# Altium project PDM-C.PrjPcb
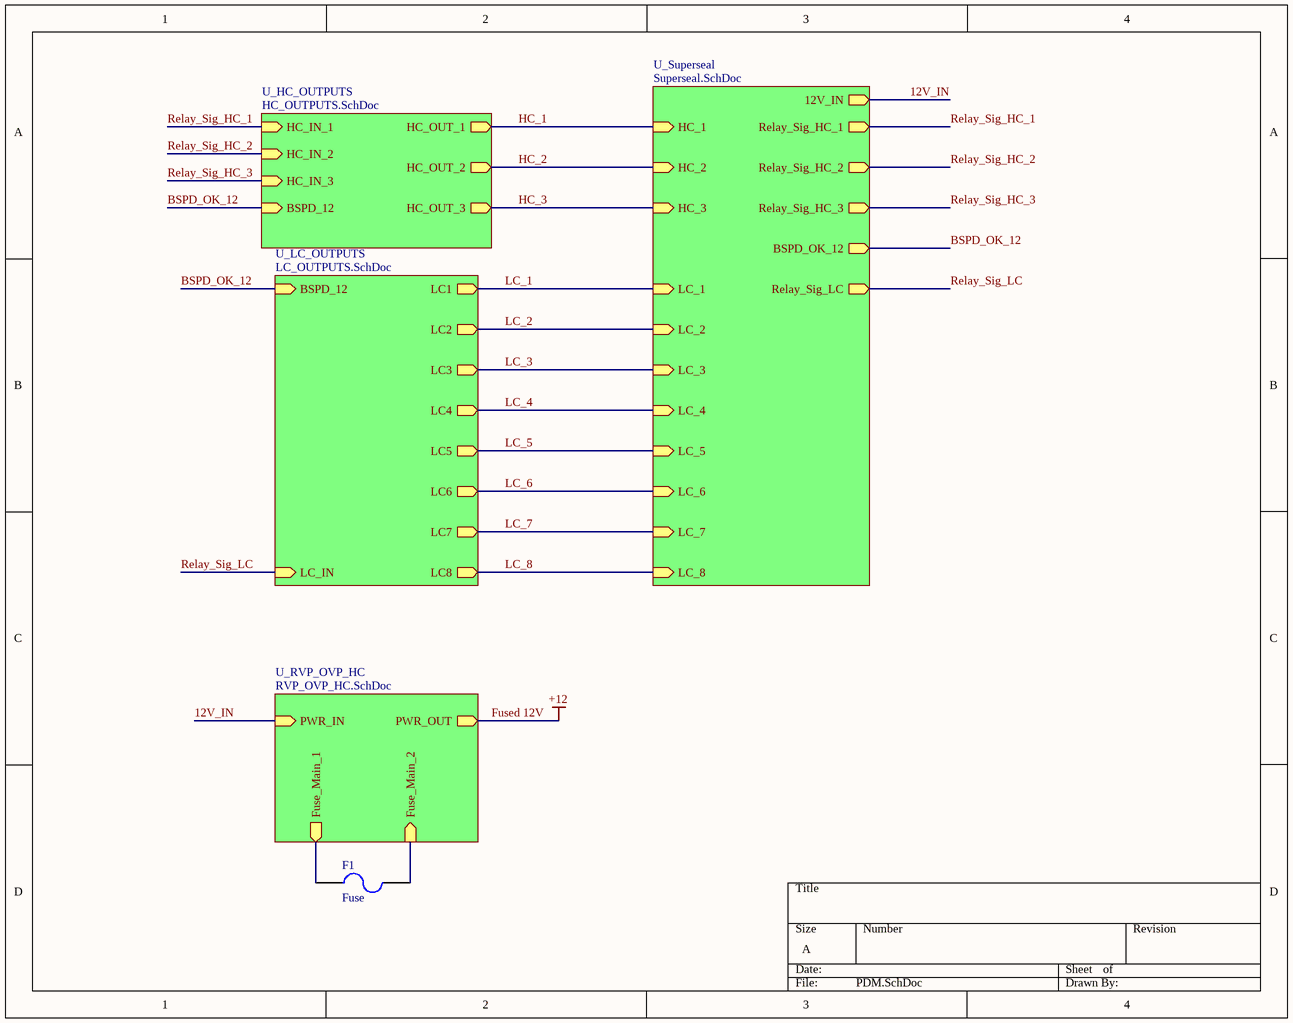
[diagram p0: PDM.SchDoc]
7 sheets, 85 parts. Net scope: hierarchical (ports join the sheet entries above them; power ports are global).
Board files: PDM-C_Rev2.PcbDoc, PDM-C_Rev3.PcbDoc
Sheets:
  PDM.SchDoc
    U_LC_OUTPUTS = LC_OUTPUTS.SchDoc
      U_Blown_Fuse_LED = Blown_Fuse_LED.SchDoc
      U_Relay = Relay.SchDoc
      U_Blown_Fuse_LED = Blown_Fuse_LED.SchDoc
      U_Blown_Fuse_LED = Blown_Fuse_LED.SchDoc
      U_Blown_Fuse_LED = Blown_Fuse_LED.SchDoc
      U_Blown_Fuse_LED = Blown_Fuse_LED.SchDoc
      U_Blown_Fuse_LED = Blown_Fuse_LED.SchDoc
      U_Blown_Fuse_LED = Blown_Fuse_LED.SchDoc
      U_Blown_Fuse_LED = Blown_Fuse_LED.SchDoc
    U_HC_OUTPUTS = HC_OUTPUTS.SchDoc
      U_Blown_Fuse_LED = Blown_Fuse_LED.SchDoc
      U_Relay = Relay.SchDoc
      U_Blown_Fuse_LED = Blown_Fuse_LED.SchDoc
      U_Relay = Relay.SchDoc
      U_Blown_Fuse_LED = Blown_Fuse_LED.SchDoc
      U_Relay = Relay.SchDoc
    U_RVP_OVP_HC = RVP_OVP_HC.SchDoc
    U_Superseal = Superseal.SchDoc

## Sheet PDM.SchDoc
size A

### Parts
(Parts that share a designator on the sheet are numbered #1, #2 ... from top to bottom, then left to right.)
F1#1  Fuse  [3568-MiniFuseHolder]

### Sub-sheets
U_HC_OUTPUTS = HC_OUTPUTS.SchDoc: HC_IN_1 (in), HC_OUT_1 (out), HC_IN_2 (in), HC_OUT_2 (out), HC_IN_3 (in), HC_OUT_3 (out), BSPD_12 (in)
U_LC_OUTPUTS = LC_OUTPUTS.SchDoc: LC8 (out), LC1 (out), LC2 (out), LC3 (out), LC4 (out), LC5 (out), LC6 (out), LC7 (out), LC_IN (in), BSPD_12 (in)
U_RVP_OVP_HC = RVP_OVP_HC.SchDoc: PWR_IN (in), PWR_OUT (out), Fuse_Main_1 (out), Fuse_Main_2 (in)
U_Superseal = Superseal.SchDoc: 12V_IN (out), Relay_Sig_LC (out), Relay_Sig_HC_1 (out), Relay_Sig_HC_2 (out), HC_1 (in), HC_2 (in), LC_1 (in), LC_2 (in), LC_3 (in), LC_4 (in), LC_5 (in), LC_6 (in), LC_7 (in), LC_8 (in), Relay_Sig_HC_3 (out), HC_3 (in), BSPD_OK_12 (out)

### Nets
Fused 12V: F1#1.2 ; sheet U_RVP_OVP_HC/PWR_OUT, sheet U_RVP_OVP_HC/Fuse_Main_2  [also labelled +12]
12V_IN: F1#1.1 ; sheet U_RVP_OVP_HC/PWR_IN, sheet U_RVP_OVP_HC/Fuse_Main_1, sheet U_Superseal/12V_IN
BSPD_OK_12: sheet U_LC_OUTPUTS/BSPD_12, sheet U_HC_OUTPUTS/BSPD_12, sheet U_Superseal/BSPD_OK_12  [project net BSPD_12]
HC_1: sheet U_HC_OUTPUTS/HC_OUT_1, sheet U_Superseal/HC_1
HC_2: sheet U_HC_OUTPUTS/HC_OUT_2, sheet U_Superseal/HC_2
HC_3: sheet U_HC_OUTPUTS/HC_OUT_3, sheet U_Superseal/HC_3
LC_1: sheet U_LC_OUTPUTS/LC1, sheet U_Superseal/LC_1
LC_2: sheet U_LC_OUTPUTS/LC2, sheet U_Superseal/LC_2
LC_3: sheet U_LC_OUTPUTS/LC3, sheet U_Superseal/LC_3
LC_4: sheet U_LC_OUTPUTS/LC4, sheet U_Superseal/LC_4
LC_5: sheet U_LC_OUTPUTS/LC5, sheet U_Superseal/LC_5
LC_6: sheet U_LC_OUTPUTS/LC6, sheet U_Superseal/LC_6
LC_7: sheet U_LC_OUTPUTS/LC7, sheet U_Superseal/LC_7
LC_8: sheet U_LC_OUTPUTS/LC8, sheet U_Superseal/LC_8
Relay_Sig_HC_1: sheet U_HC_OUTPUTS/HC_IN_1, sheet U_Superseal/Relay_Sig_HC_1
Relay_Sig_HC_2: sheet U_HC_OUTPUTS/HC_IN_2, sheet U_Superseal/Relay_Sig_HC_2
Relay_Sig_HC_3: sheet U_HC_OUTPUTS/HC_IN_3, sheet U_Superseal/Relay_Sig_HC_3
Relay_Sig_LC: sheet U_LC_OUTPUTS/LC_IN, sheet U_Superseal/Relay_Sig_LC

### Library data of the parts
F1#1 = 3: Manufacturer_id: 1; idFuse: 3; Name: 3568 Mini Fuse Holder; Drawer_id: 1

## Sheet LC_OUTPUTS.SchDoc
size A
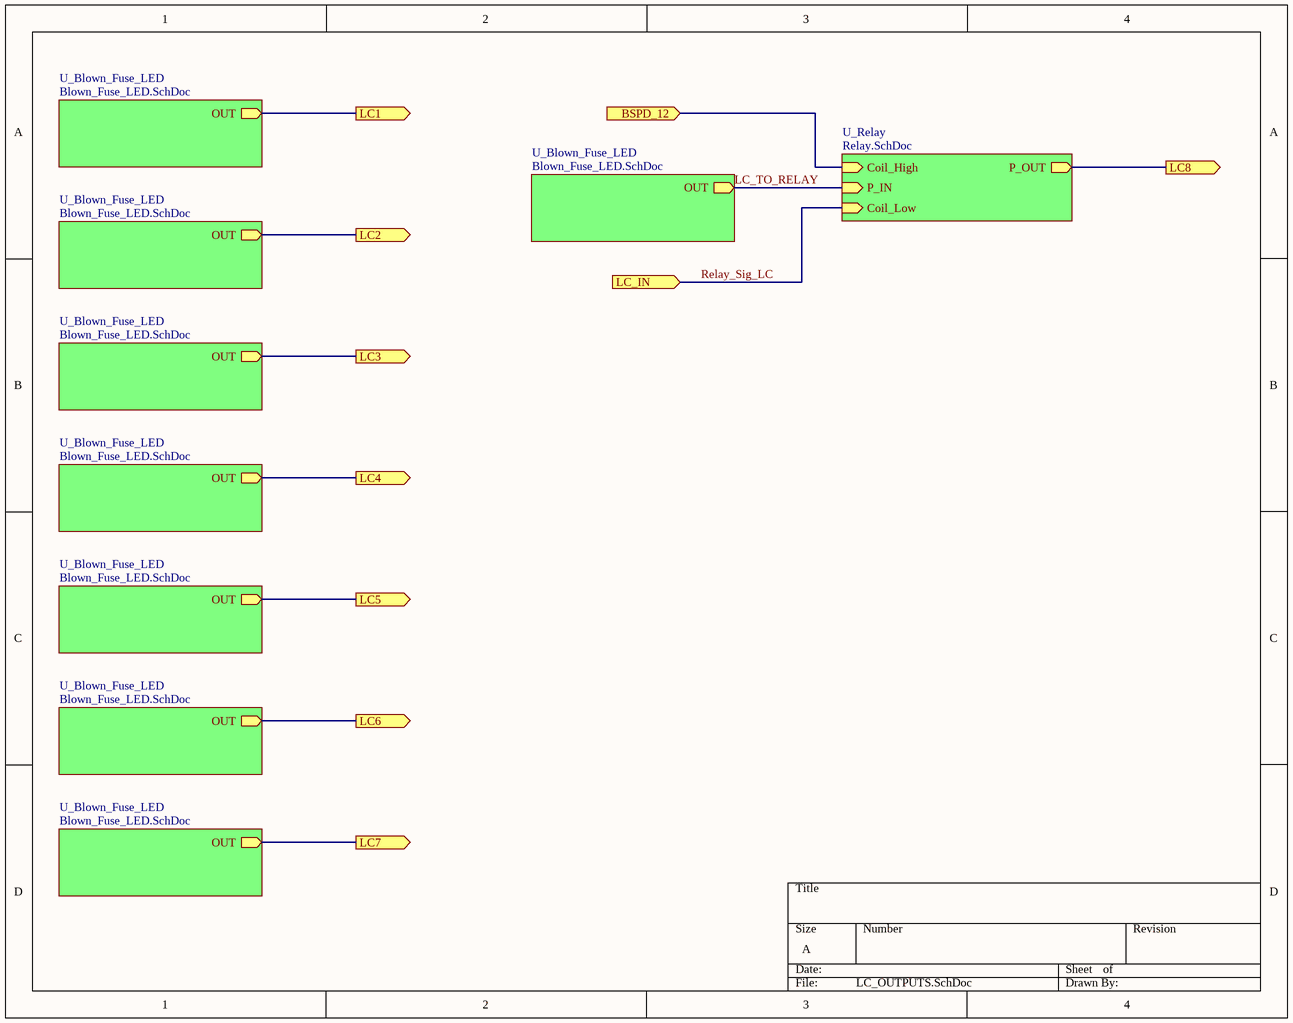
[diagram p1: LC_OUTPUTS.SchDoc]

### Sub-sheets
U_Blown_Fuse_LED = Blown_Fuse_LED.SchDoc: OUT (out)
U_Blown_Fuse_LED = Blown_Fuse_LED.SchDoc: OUT (out)
U_Blown_Fuse_LED = Blown_Fuse_LED.SchDoc: OUT (out)
U_Blown_Fuse_LED = Blown_Fuse_LED.SchDoc: OUT (out)
U_Blown_Fuse_LED = Blown_Fuse_LED.SchDoc: OUT (out)
U_Blown_Fuse_LED = Blown_Fuse_LED.SchDoc: OUT (out)
U_Blown_Fuse_LED = Blown_Fuse_LED.SchDoc: OUT (out)
U_Blown_Fuse_LED = Blown_Fuse_LED.SchDoc: OUT (out)
U_Relay = Relay.SchDoc: P_OUT (out), P_IN (in), Coil_High (in), Coil_Low (in)

### Ports
BSPD_12 (in), LC1 (out), LC2 (out), LC3 (out), LC4 (out), LC5 (out), LC6 (out), LC7 (out), LC8 (out), LC_IN (in)

### Nets
BSPD_12: port BSPD_12, sheet U_Relay/Coil_High
LC_1: port LC1, sheet U_Blown_Fuse_LED/OUT
LC_2: port LC2, sheet U_Blown_Fuse_LED/OUT
LC_3: port LC3, sheet U_Blown_Fuse_LED/OUT
LC_4: port LC4, sheet U_Blown_Fuse_LED/OUT
LC_5: port LC5, sheet U_Blown_Fuse_LED/OUT
LC_6: port LC6, sheet U_Blown_Fuse_LED/OUT
LC_7: port LC7, sheet U_Blown_Fuse_LED/OUT
LC_8: port LC8, sheet U_Relay/P_OUT
LC_TO_RELAY: sheet U_Blown_Fuse_LED/OUT, sheet U_Relay/P_IN
Relay_Sig_LC: port LC_IN, sheet U_Relay/Coil_Low

## Sheet Blown_Fuse_LED.SchDoc
size A
Used 11 times, as channels U_LC_OUTPUTS/U_Blown_Fuse_LED, U_LC_OUTPUTS/U_Blown_Fuse_LED, U_LC_OUTPUTS/U_Blown_Fuse_LED, U_LC_OUTPUTS/U_Blown_Fuse_LED, U_LC_OUTPUTS/U_Blown_Fuse_LED, U_LC_OUTPUTS/U_Blown_Fuse_LED, U_LC_OUTPUTS/U_Blown_Fuse_LED, U_LC_OUTPUTS/U_Blown_Fuse_LED, U_HC_OUTPUTS/U_Blown_Fuse_LED, U_HC_OUTPUTS/U_Blown_Fuse_LED, U_HC_OUTPUTS/U_Blown_Fuse_LED. Parts and nets are listed once, with the designators drawn on the sheet.
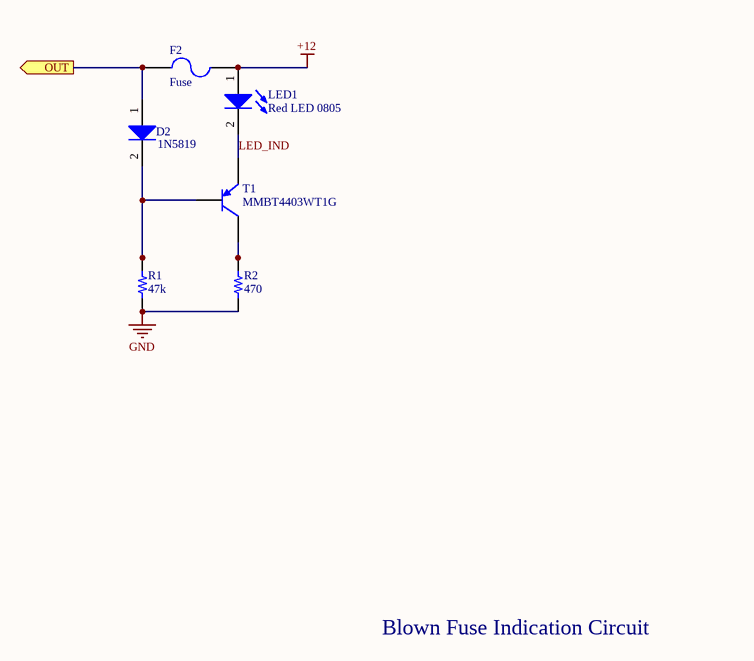
[diagram p2: Blown_Fuse_LED.SchDoc]

### Parts
D2  1N5819  [SOD123F]
F2  Fuse  [3568-MiniFuseHolder]
LED1  Red LED 0805  [0805_LED]
R1  value 47k  [RES 0805/2012]  (hidden comment: Resistor 47k 0805 1/10W 1%)
R2  value 470  [RES 0805/2012]  (hidden comment: Resistor 470 0805 1/10W 1%)
T1  MMBT4403WT1G  [SOT23-3]

### Ports
OUT (out)

### Nets
+12: F2.2 LED1.1(A)
GND: R1.2 R2.2
LED_IND: LED1.2(K) T1.2(E)
OUT: D2.1(A) F2.1 ; port OUT
NetD2_2: D2.2(K) R1.1 T1.1(B)
NetR2_1: R2.1 T1.3(C)

### Channels
U_LC_OUTPUTS/U_Blown_Fuse_LED: designators D2=D11 F2=F11 LED1=LED11 R1=R21 R2=R22 T1=T11; ports OUT=LC_TO_RELAY
U_LC_OUTPUTS/U_Blown_Fuse_LED: designators D2=D10 F2=F10 LED1=LED10 R1=R19 R2=R20 T1=T10; ports OUT=LC_1
U_LC_OUTPUTS/U_Blown_Fuse_LED: designators D2=D9 F2=F9 LED1=LED9 R1=R17 R2=R18 T1=T9; ports OUT=LC_2
U_LC_OUTPUTS/U_Blown_Fuse_LED: designators D2=D8 F2=F8 LED1=LED8 R1=R15 R2=R16 T1=T8; ports OUT=LC_3
U_LC_OUTPUTS/U_Blown_Fuse_LED: designators D2=D7 F2=F7 LED1=LED7 R1=R13 R2=R14 T1=T7; ports OUT=LC_4
U_LC_OUTPUTS/U_Blown_Fuse_LED: designators D2=D6 F2=F6 LED1=LED6 R1=R11 R2=R12 T1=T6; ports OUT=LC_5
U_LC_OUTPUTS/U_Blown_Fuse_LED: designators D2=D5 F2=F5 LED1=LED5 R1=R9 R2=R10 T1=T5; ports OUT=LC_6
U_LC_OUTPUTS/U_Blown_Fuse_LED: designators D2=D4#1 F2=F4 LED1=LED4 R1=R7 R2=R8 T1=T4; ports OUT=LC_7
U_HC_OUTPUTS/U_Blown_Fuse_LED: designators D2=D3#1 F2=F3 LED1=LED3 R1=R5 R2=R6 T1=T3; ports OUT=HC1_TO_RELAY
U_HC_OUTPUTS/U_Blown_Fuse_LED: designators D2=D2 F2=F2 LED1=LED2#1 R1=R3#1 R2=R4#1 T1=T2#1; ports OUT=HC3_TO_RELAY
U_HC_OUTPUTS/U_Blown_Fuse_LED: designators D2=D1 F2=F1#2 LED1=LED1 R1=R1 R2=R2 T1=T1; ports OUT=HC2_TO_RELAY

### Notes on the sheet
- Blown Fuse Indication Circuit

### Library data of the parts
D2 = 2: Diode Super Barrier 40V 1A Surface Mount SOD-123F; Manufacturer_id: 1; MfrPartNo: 1N5819HW1-7-F; idDiode: 2; Drawer_id: 1; Name: 1N5819; Value: 1A; Type: Super Barrier; Num_Circuits: 1; Ic: 1A; Power: 40V; Package: SOD-123; Link: https://www.digikey.com/product-detail/en/diodes-incorporated/1N5819HW1-7-F/1N5819HW1-7-FDITR-ND/5768523; ComponentLink1Description: Datasheet; ComponentLink1URL: https://www.diodes.com/assets/Datasheets/1N5819HW1.pdf; Supplier1: Digi-Key; Supplier1PartNo: 1N5819HW1-7-FDITR-ND
F2 = 3: as F1#1 on sheet PDM; Drawer_id: 1
LED1 = 1: idLED: 1; Name: LED_0805_RED; Vf: 0.7V; Manufacturer_id: 1; Drawer_id: 1; Value: Red; Package: 0805
R1 = 545: Manufacturer_id: 1; idResistor: 545; Name: Res_47k_0805_1/10W_1%; Created_By: Nick Mah; Supplier 1: Digi-Key; Drawer_id: 1; Tolerance: 1%; Power: 1/10W; Package: 0805; ComponentLink1Description: Datasheet; Created_Date: 2018-10-20
R2 = 497: Manufacturer_id: 1; idResistor: 497; Name: Res_470_0805_1/10W_1%; Created_By: Nick Mah; Supplier 1: Digi-Key; Drawer_id: 1; Tolerance: 1%; Power: 1/10W; Package: 0805; ComponentLink1Description: Datasheet; Created_Date: 2018-10-20
T1 = 3: Manufacturer_id: 1; idBJT: 3; Type: PNP; Ic: 600mA; Vce(Max): -40V; Created_By: Angel; Drawer_id: 1; Name: MMBT4403WT1G; Num_Circuits: 1; Package: SOT23-3; MfrPartNo: MMBT4403WT1G; Link: https://www.digikey.com/product-detail/en/on-semiconductor/MMBT4403WT1G/MMBT4403WT1GOSCT-ND/3487572

## Sheet Relay.SchDoc
size A
Used 4 times, as channels U_LC_OUTPUTS/U_Relay, U_HC_OUTPUTS/U_Relay, U_HC_OUTPUTS/U_Relay, U_HC_OUTPUTS/U_Relay. Parts and nets are listed once, with the designators drawn on the sheet.
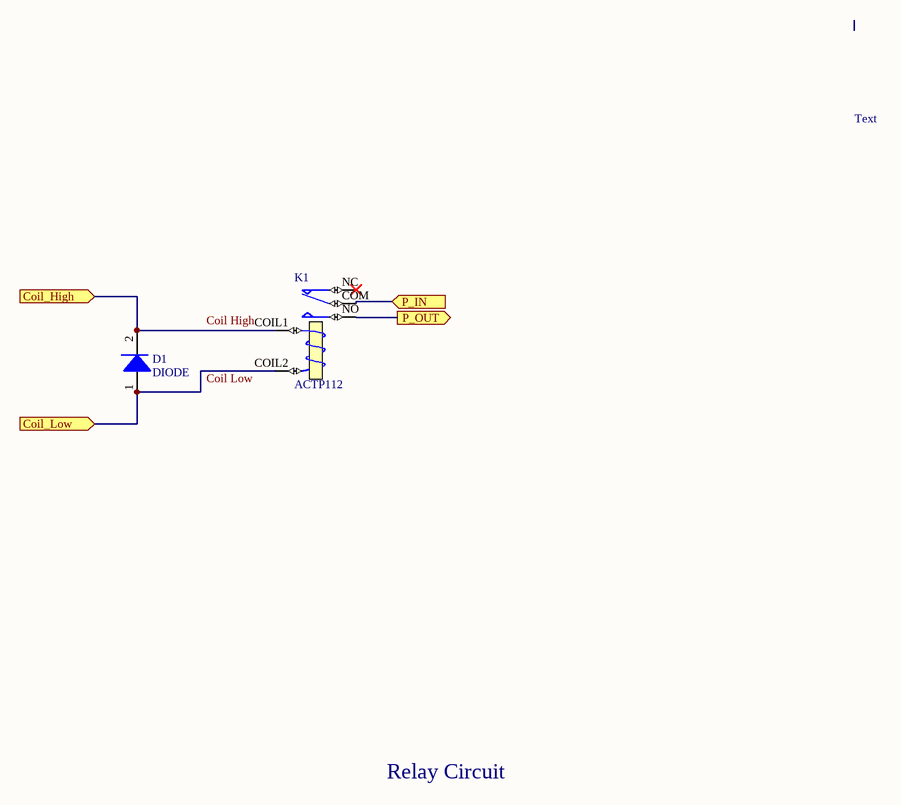
[diagram p3: Relay.SchDoc]

### Parts
D1  DIODE  [SOD123F]
K1  ACTP112  [ACTP112]

### Ports
Coil_High (in), Coil_Low (in), P_IN (in), P_OUT (out)

### Nets
Coil_High: D1.2(K) K1.COIL1(T1) ; port Coil_High
Coil_Low: D1.1(A) K1.COIL2(T2) ; port Coil_Low
P_IN: K1.COM ; port P_IN
P_OUT: K1.NO ; port P_OUT

Not connected (* = marked no-connect by the designer): K1 NC*

### Channels
U_LC_OUTPUTS/U_Relay: designators D1=D15 K1=K4; ports Coil_High=BSPD_12 Coil_Low=Relay_Sig_LC P_IN=LC_TO_RELAY P_OUT=LC_8
U_HC_OUTPUTS/U_Relay: designators D1=D14 K1=K3; ports Coil_High=BSPD_12 Coil_Low=Relay_Sig_HC_1 P_IN=HC1_TO_RELAY P_OUT=HC_1
U_HC_OUTPUTS/U_Relay: designators D1=D13 K1=K2; ports Coil_High=BSPD_12 Coil_Low=Relay_Sig_HC_3 P_IN=HC3_TO_RELAY P_OUT=HC_3
U_HC_OUTPUTS/U_Relay: designators D1=D12 K1=K1; ports Coil_High=BSPD_12 Coil_Low=Relay_Sig_HC_2 P_IN=HC2_TO_RELAY P_OUT=HC_2

### Notes on the sheet
- Text
- Relay Circuit
- Labels drawn without touching a wire or pin: Coil High, Coil Low

### Library data of the parts
D1 = 2: Diode Super Barrier 40V 1A Surface Mount SOD-123F; Manufacturer_id: 1; MfrPartNo: 1N5819HW1-7-F; idDiode: 2; Name: 1N5819; Drawer_id: 1; Value: 1A; Type: Super Barrier; Num_Circuits: 1; Ic: 1A; Power: 40V; Package: SOD-123; Link: https://www.digikey.com/product-detail/en/diodes-incorporated/1N5819HW1-7-F/1N5819HW1-7-FDITR-ND/5768523; ComponentLink1Description: Datasheet; ComponentLink1URL: https://www.diodes.com/assets/Datasheets/1N5819HW1.pdf; Supplier1: Digi-Key; Supplier1PartNo: 1N5819HW1-7-FDITR-ND
K1 = 3: Manufacturer_id: 1; idRelay: 3; Coil_Voltage: 12V; Published: 8-Jun-2000; LatestRevisionDate: 17-Jul-2002; LatestRevisionNote: Re-released for DXP Platform.; PackageReference: MODULE5B; Publisher: Altium Limited; Drawer_id: 1; Name: ACTP112

## Sheet HC_OUTPUTS.SchDoc
size A
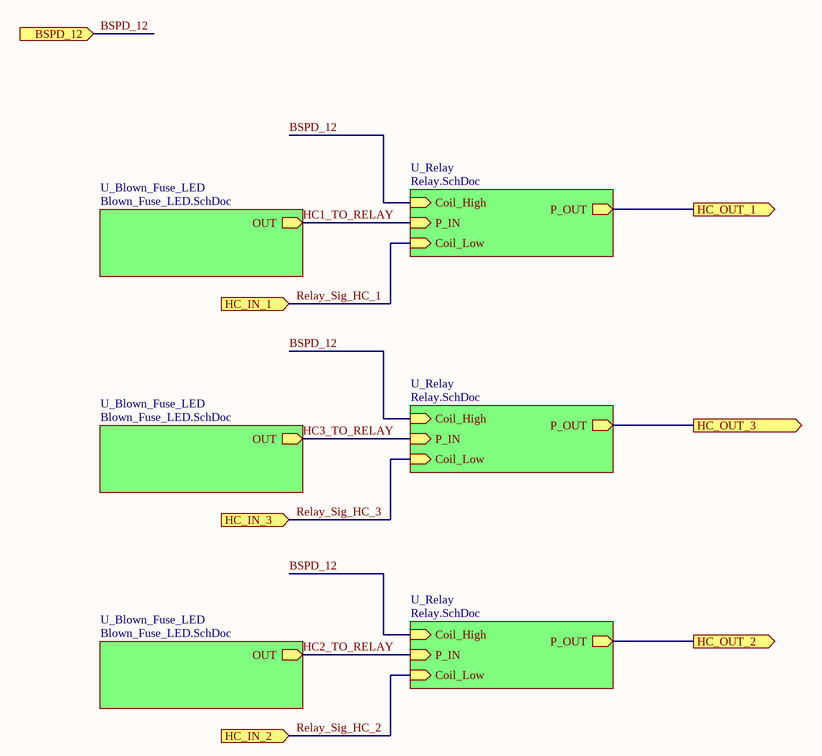
[diagram p4: HC_OUTPUTS.SchDoc]

### Sub-sheets
U_Blown_Fuse_LED = Blown_Fuse_LED.SchDoc: OUT (out)
U_Blown_Fuse_LED = Blown_Fuse_LED.SchDoc: OUT (out)
U_Blown_Fuse_LED = Blown_Fuse_LED.SchDoc: OUT (out)
U_Relay = Relay.SchDoc: P_OUT (out), P_IN (in), Coil_High (in), Coil_Low (in)
U_Relay = Relay.SchDoc: P_OUT (out), P_IN (in), Coil_High (in), Coil_Low (in)
U_Relay = Relay.SchDoc: P_OUT (out), P_IN (in), Coil_High (in), Coil_Low (in)

### Ports
BSPD_12 (in), HC_IN_1 (in), HC_IN_2 (in), HC_IN_3 (in), HC_OUT_1 (out), HC_OUT_2 (out), HC_OUT_3 (out)

### Nets
BSPD_12: port BSPD_12, sheet U_Relay/Coil_High, sheet U_Relay/Coil_High, sheet U_Relay/Coil_High
HC1_TO_RELAY: sheet U_Blown_Fuse_LED/OUT, sheet U_Relay/P_IN
HC2_TO_RELAY: sheet U_Blown_Fuse_LED/OUT, sheet U_Relay/P_IN
HC3_TO_RELAY: sheet U_Blown_Fuse_LED/OUT, sheet U_Relay/P_IN
HC_1: port HC_OUT_1, sheet U_Relay/P_OUT
HC_2: port HC_OUT_2, sheet U_Relay/P_OUT
HC_3: port HC_OUT_3, sheet U_Relay/P_OUT
Relay_Sig_HC_1: port HC_IN_1, sheet U_Relay/Coil_Low
Relay_Sig_HC_2: port HC_IN_2, sheet U_Relay/Coil_Low
Relay_Sig_HC_3: port HC_IN_3, sheet U_Relay/Coil_Low

## Sheet RVP_OVP_HC.SchDoc
size A
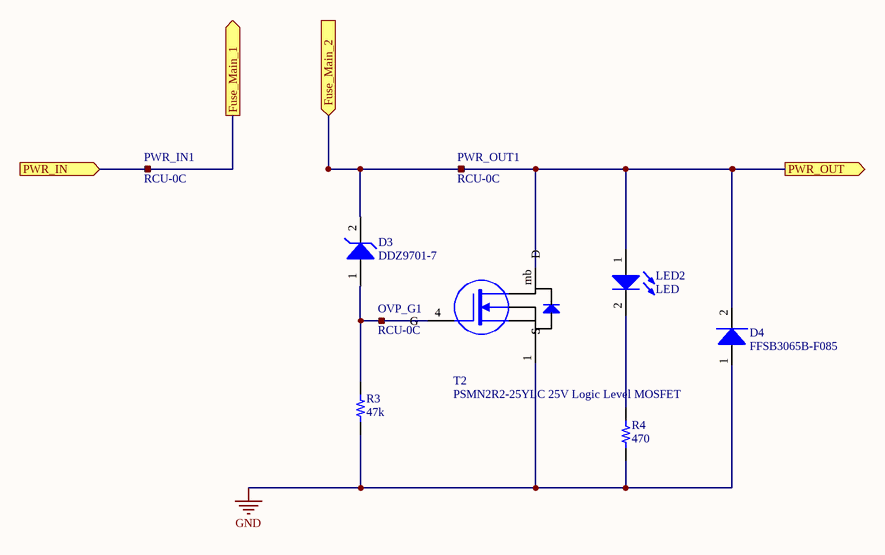
[diagram p5: RVP_OVP_HC.SchDoc]

### Parts
(Parts that share a designator on the sheet are numbered #1, #2 ... from top to bottom, then left to right.)
D3#2  DDZ9701-7  [SOD123F]
D4#2  FFSB3065B-F085  [FFSB3065B-F085]
LED2#2  LED  [0805_LED]
OVP_G1  RCU-0C  [RCU-0C]
PWR_IN1  RCU-0C  [RCU-0C]
PWR_OUT1  RCU-0C  [RCU-0C]
R3#2  value 47k  [RES 0805/2012]  (hidden comment: Resistor 47k 0805 1/10W 1%)
R4#2  value 470  [RES 0805/2012]  (hidden comment: Resistor 470 0805 1/10W 1%)
T2#2  PSMN2R2-25YLC 25V Logic Level MOSFET  [LFPAK-SO8]

### Ports
Fuse_Main_1 (out), Fuse_Main_2 (in), PWR_IN (in), PWR_OUT (out)

### Nets
Fused 12V: D3#2.2(K) D4#2.2(K) LED2#2.1(A) PWR_OUT1.1 T2#2.mb(D) ; port PWR_OUT, port Fuse_Main_2
GND: D4#2.1(A) R3#2.1 R4#2.1 T2#2.1(S) T2#2.2(S) T2#2.3(S)
12V_IN: PWR_IN1.1 ; port PWR_IN, port Fuse_Main_1
NetD3#2_1: D3#2.1(A) OVP_G1.1 R3#2.2 T2#2.4(G)
NetLED2#2_2: LED2#2.2(K) R4#2.2

### Library data of the parts
D3#2 = 10: Zener Diode 14V 500mW ±5% Surface Mount SOD-123; Manufacturer_id: 8; idDiode: 10; Drawer_id: 1; Value: 14Vz; MfrPartNo: DDZ9701-7; Name: DDZ9701; Type: Zener; Num_Circuits: 1; Power: 500mW; Package: SOD-123; Link: https://www.digikey.com/product-detail/en/diodes-incorporated/DDZ9701-7/DDZ9701-7DICT-ND/3877402; ComponentLink1Description: Datasheet; ComponentLink1URL: https://www.diodes.com/assets/Datasheets/ds30410.pdf; Supplier1: Digi-Key; Supplier1PartNo: DDZ9701-7DICT-ND
D4#2 = 24: Diode Silicon Carbide Schottky 650V 73A (DC); id: 24; vr: 1.37999999523163; numcircuits: 1; name: FFSB3065B-F085; package: D2PAK (TO-; quantity: 0; link: https://www.digikey.com/product-detail/en/on-semiconductor/FFSB3065B-F085/FFSB3065B-F085OSCT-ND/9764831; createdby: Kevin
LED2#2 = 2: Manufacturer_id: 1; idLED: 2; Name: CMD17_0805_GREEN; Value: Green; Brightness: 7mcd; Id: 20mA; Vf: 2.1V; Drawer_id: 1; Package: 0805; Link: https://www.digikey.com/product-detail/en/visual-communications-company-vcc/CMD17-21VGD-TR8/L62505CT-ND/254936
OVP_G1 PWR_IN1 PWR_OUT1 = 5: Manufacturer_id: 1; idTable: 5; Name: RCU-0C_Test_Point; Drawer_id: 1; Package: 0603; MfrPartNo: RCU-0C; Link: https://www.digikey.com/product-detail/en/te-connectivity-amp-connectors/RCU-0C/A106145CT-ND/3477802; ComponentLink1Description: Datasheet; ComponentLink1URL: https://www.te.com/commerce/DocumentDelivery/DDEController?Action=srchrtrv&DocNm=1773266&DocType=DS&DocLang=English
R3#2 = 545: as R1 on sheet Blown_Fuse_LED; Supplier 1: Digi-Key; Drawer_id: 1; Tolerance: 1%; Power: 1/10W; Package: 0805; ComponentLink1Description: Datasheet; Created_Date: 2018-10-20
R4#2 = 497: as R2 on sheet Blown_Fuse_LED; Supplier 1: Digi-Key; Drawer_id: 1; Tolerance: 1%; Power: 1/10W; Package: 0805; ComponentLink1Description: Datasheet; Created_Date: 2018-10-20
T2#2 = 3: N-Channel 25V 100A (Tc) 106W (Tc) Surface Mount LFPAK56, Power-SO8; Manufacturer_id: 6; MfrPartNo: PSMN2R2-25YLC,115; idFETs: 3; Drawer_id: 1; Value: N_Channel; Rds_On: 2.5mOhm; Vgs(typ): 10V; Vgs(Max): 20V; Created_By: Nick; Name: PSMN2R2; Vdss: 25V; Num_Circuits: 1; Id: 100A; Package: LFPAK-SO8; Link: https://www.digikey.com/product-detail/en/nexperia-usa-inc/PSMN2R2-25YLC115/1727-5299-1-ND/2674299; ComponentLink1Description: Datasheet; ComponentLink1URL: https://assets.nexperia.com/documents/data-sheet/PSMN2R2-25YLC.pdf; Supplier1: Digi-Key; Supplier1PartNo: 1727-5299-1-ND

## Sheet Superseal.SchDoc
size A
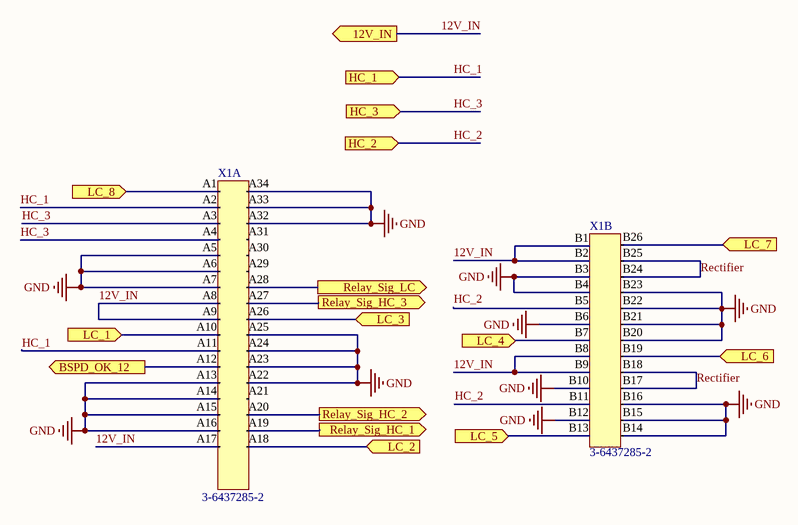
[diagram p6: Superseal.SchDoc]

### Parts
X1  3-6437285-2  [SUPERSEAL 60POS 90Deg]  (parts A,B of 2)

### Ports
12V_IN (out), BSPD_OK_12 (out), HC_1 (in), HC_2 (in), HC_3 (in), LC_1 (in), LC_2 (in), LC_3 (in), LC_4 (in), LC_5 (in), LC_6 (in), LC_7 (in), LC_8 (in), Relay_Sig_HC_1 (out), Relay_Sig_HC_2 (out), Relay_Sig_HC_3 (out), Relay_Sig_LC (out)

### Nets
GND: X1.A5 X1.A6 X1.A7 X1.A13 X1.A14 X1.A15 X1.A16 X1.A22 X1.A23 X1.A24 X1.A25 X1.A32 X1.A33 X1.A34 X1.B3 X1.B4 X1.B6 X1.B10 X1.B12 X1.B14 X1.B15 X1.B16 X1.B20 X1.B21 X1.B22 X1.B23
12V_IN: X1.A8 X1.A9 X1.A17 X1.B1 X1.B2 X1.B8 X1.B9 ; port 12V_IN
BSPD_12: X1.A12 ; port BSPD_OK_12
HC_1: X1.A2 X1.A11 ; port HC_1
HC_2: X1.B5 X1.B11 ; port HC_2
HC_3: X1.A3 X1.A4 ; port HC_3
LC_1: X1.A10 ; port LC_1
LC_2: X1.A18 ; port LC_2
LC_3: X1.A26 ; port LC_3
LC_4: X1.B7 ; port LC_4
LC_5: X1.B13 ; port LC_5
LC_6: X1.B19 ; port LC_6
LC_7: X1.B26 ; port LC_7
LC_8: X1.A1 ; port LC_8
Rectifier: X1.B17 X1.B18 X1.B24 X1.B25
Relay_Sig_HC_1: X1.A19 ; port Relay_Sig_HC_1
Relay_Sig_HC_2: X1.A20 ; port Relay_Sig_HC_2
Relay_Sig_HC_3: X1.A27 ; port Relay_Sig_HC_3
Relay_Sig_LC: X1.A28 ; port Relay_Sig_LC

Not connected (* = marked no-connect by the designer): X1 A21 A29 A30 A31

### Library data of the parts
X1 = 3: 90 Degree; Manufacturer_id: 1; idConn: 3; Name: AMP Superseal 60POS 90Deg; Value: CONN; Num_Contacts: 60; Num_Rows: 4; Pitch: 3 mm; MfrPartNo: 3-6437285-2; Drawer_id: 1; Link: https://www.te.com/usa-en/product-3-6437285-2.html; ComponentLink1Description: Datasheet

## Nets that join several sheets
Fused 12V: PDM (F1#1.2), U_LC_OUTPUTS/U_Blown_Fuse_LED (F11.2 LED11.1), U_LC_OUTPUTS/U_Blown_Fuse_LED (F10.2 LED10.1), U_LC_OUTPUTS/U_Blown_Fuse_LED (F9.2 LED9.1), U_LC_OUTPUTS/U_Blown_Fuse_LED (F8.2 LED8.1), U_LC_OUTPUTS/U_Blown_Fuse_LED (F7.2 LED7.1), U_LC_OUTPUTS/U_Blown_Fuse_LED (F6.2 LED6.1), U_LC_OUTPUTS/U_Blown_Fuse_LED (F5.2 LED5.1), U_LC_OUTPUTS/U_Blown_Fuse_LED (F4.2 LED4.1), U_HC_OUTPUTS/U_Blown_Fuse_LED (F3.2 LED3.1), U_HC_OUTPUTS/U_Blown_Fuse_LED (F2.2 LED2#1.1), U_HC_OUTPUTS/U_Blown_Fuse_LED (F1#2.2 LED1.1), RVP_OVP_HC (5 pins)
GND: U_LC_OUTPUTS/U_Blown_Fuse_LED (R21.2 R22.2), U_LC_OUTPUTS/U_Blown_Fuse_LED (R19.2 R20.2), U_LC_OUTPUTS/U_Blown_Fuse_LED (R17.2 R18.2), U_LC_OUTPUTS/U_Blown_Fuse_LED (R15.2 R16.2), U_LC_OUTPUTS/U_Blown_Fuse_LED (R13.2 R14.2), U_LC_OUTPUTS/U_Blown_Fuse_LED (R11.2 R12.2), U_LC_OUTPUTS/U_Blown_Fuse_LED (R9.2 R10.2), U_LC_OUTPUTS/U_Blown_Fuse_LED (R7.2 R8.2), U_HC_OUTPUTS/U_Blown_Fuse_LED (R5.2 R6.2), U_HC_OUTPUTS/U_Blown_Fuse_LED (R3#1.2 R4#1.2), U_HC_OUTPUTS/U_Blown_Fuse_LED (R1.2 R2.2), RVP_OVP_HC (6 pins), Superseal (26 pins)
12V_IN: PDM (F1#1.1), RVP_OVP_HC (PWR_IN1.1), Superseal (7 pins)
BSPD_12: U_LC_OUTPUTS/U_Relay (D15.2 K4.COIL1), U_HC_OUTPUTS/U_Relay (D14.2 K3.COIL1), U_HC_OUTPUTS/U_Relay (D13.2 K2.COIL1), U_HC_OUTPUTS/U_Relay (D12.2 K1.COIL1), Superseal (X1.A12)
HC1_TO_RELAY: U_HC_OUTPUTS/U_Blown_Fuse_LED (D3#1.1 F3.1), U_HC_OUTPUTS/U_Relay (K3.COM)
HC2_TO_RELAY: U_HC_OUTPUTS/U_Blown_Fuse_LED (D1.1 F1#2.1), U_HC_OUTPUTS/U_Relay (K1.COM)
HC3_TO_RELAY: U_HC_OUTPUTS/U_Blown_Fuse_LED (D2.1 F2.1), U_HC_OUTPUTS/U_Relay (K2.COM)
HC_1: U_HC_OUTPUTS/U_Relay (K3.NO), Superseal (X1.A2 X1.A11)
HC_2: U_HC_OUTPUTS/U_Relay (K1.NO), Superseal (X1.B5 X1.B11)
HC_3: U_HC_OUTPUTS/U_Relay (K2.NO), Superseal (X1.A3 X1.A4)
LC_1: U_LC_OUTPUTS/U_Blown_Fuse_LED (D10.1 F10.1), Superseal (X1.A10)
LC_2: U_LC_OUTPUTS/U_Blown_Fuse_LED (D9.1 F9.1), Superseal (X1.A18)
LC_3: U_LC_OUTPUTS/U_Blown_Fuse_LED (D8.1 F8.1), Superseal (X1.A26)
LC_4: U_LC_OUTPUTS/U_Blown_Fuse_LED (D7.1 F7.1), Superseal (X1.B7)
LC_5: U_LC_OUTPUTS/U_Blown_Fuse_LED (D6.1 F6.1), Superseal (X1.B13)
LC_6: U_LC_OUTPUTS/U_Blown_Fuse_LED (D5.1 F5.1), Superseal (X1.B19)
LC_7: U_LC_OUTPUTS/U_Blown_Fuse_LED (D4#1.1 F4.1), Superseal (X1.B26)
LC_8: U_LC_OUTPUTS/U_Relay (K4.NO), Superseal (X1.A1)
LC_TO_RELAY: U_LC_OUTPUTS/U_Blown_Fuse_LED (D11.1 F11.1), U_LC_OUTPUTS/U_Relay (K4.COM)
Relay_Sig_HC_1: U_HC_OUTPUTS/U_Relay (D14.1 K3.COIL2), Superseal (X1.A19)
Relay_Sig_HC_2: U_HC_OUTPUTS/U_Relay (D12.1 K1.COIL2), Superseal (X1.A20)
Relay_Sig_HC_3: U_HC_OUTPUTS/U_Relay (D13.1 K2.COIL2), Superseal (X1.A27)
Relay_Sig_LC: U_LC_OUTPUTS/U_Relay (D15.1 K4.COIL2), Superseal (X1.A28)